# EAGLE design picrocope_hub_v2r2 (EAGLE 9.6.2)
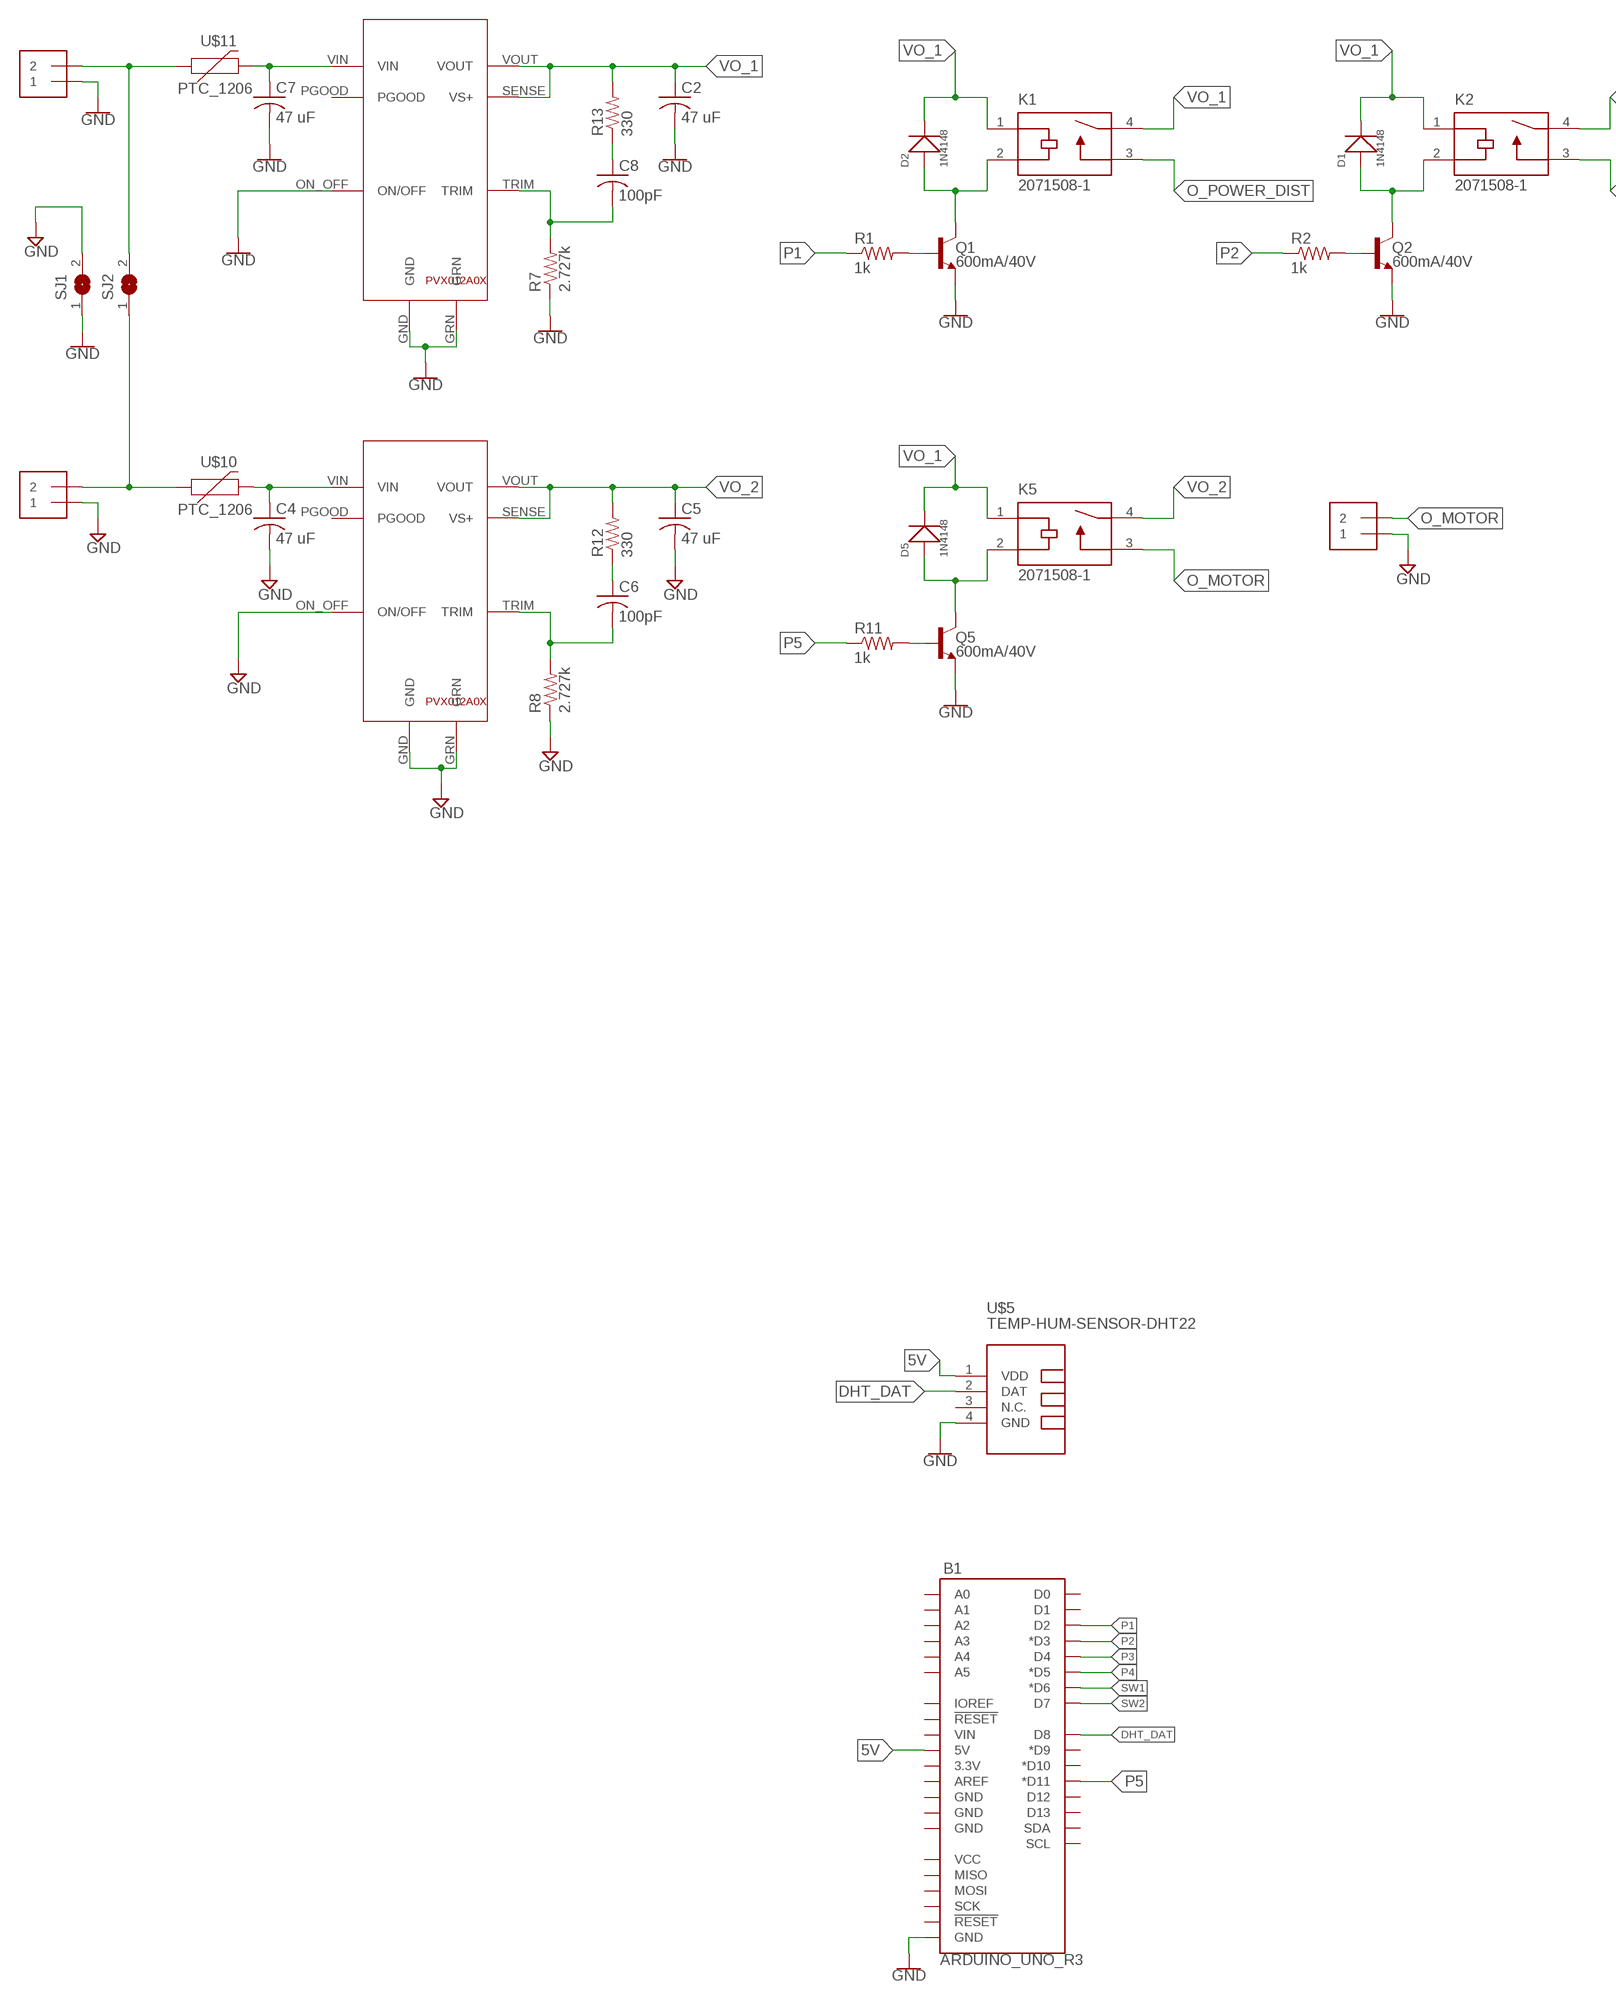
[diagram p0: schematic, sheet 1, part 1 of 2]
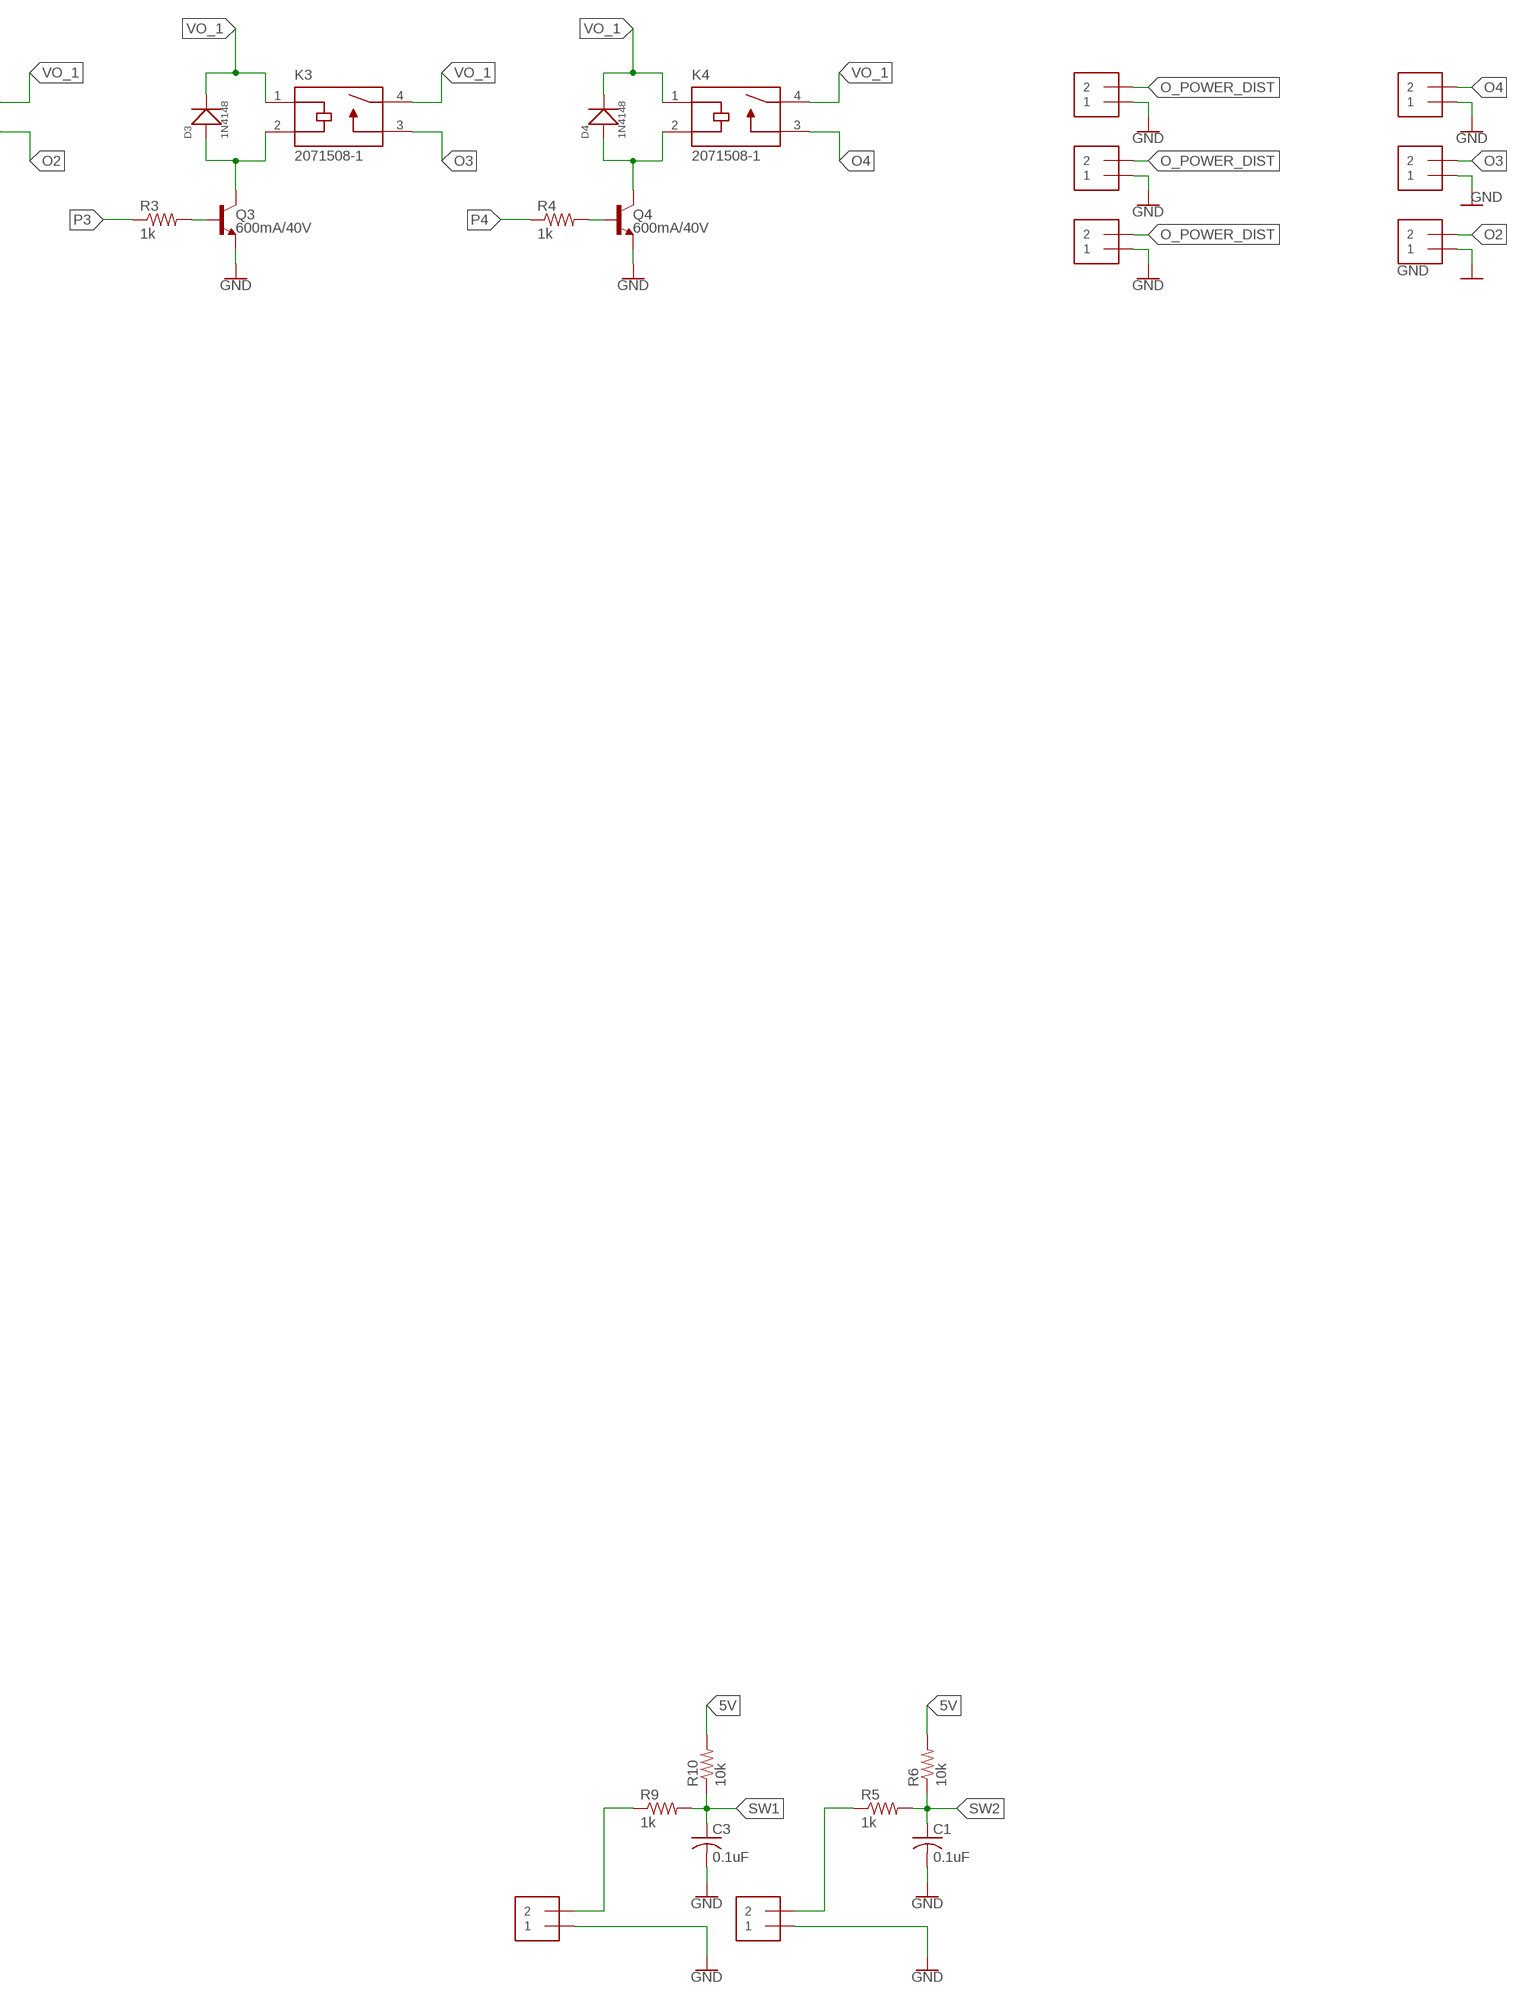
[diagram p1: schematic, sheet 1, part 2 of 2]

## Parts
B1  ARDUINO_UNO_R3  [ARDUINO_R3]
C1  0.1uF  C-USC0603  [C0603]
C2  47 uF  C-USC1210  [C1210]
C3  0.1uF  C-USC0603  [C0603]
C4  47 uF  C-USC1210  [C1210]
C5  47 uF  C-USC1210  [C1210]
C6  100pF  C-USC0603  [C0603]
C7  47 uF  C-USC1210  [C1210]
C8  100pF  C-USC0603  [C0603]
D1  1N4148  SMD-DIODE-SWITCH-1N4148(LL-34)  [LL-34]
D2  1N4148  SMD-DIODE-SWITCH-1N4148(LL-34)  [LL-34]
D3  1N4148  SMD-DIODE-SWITCH-1N4148(LL-34)  [LL-34]
D4  1N4148  SMD-DIODE-SWITCH-1N4148(LL-34)  [LL-34]
D5  1N4148  SMD-DIODE-SWITCH-1N4148(LL-34)  [LL-34]
K1  2071508-1  [RELAY_2071508-1]
K2  2071508-1  [RELAY_2071508-1]
K3  2071508-1  [RELAY_2071508-1]
K4  2071508-1  [RELAY_2071508-1]
K5  2071508-1  [RELAY_2071508-1]
Q1  600mA/40V  TRANS_NPN-MMBT2222AL  [SOT23-3]
Q2  600mA/40V  TRANS_NPN-MMBT2222AL  [SOT23-3]
Q3  600mA/40V  TRANS_NPN-MMBT2222AL  [SOT23-3]
Q4  600mA/40V  TRANS_NPN-MMBT2222AL  [SOT23-3]
Q5  600mA/40V  TRANS_NPN-MMBT2222AL  [SOT23-3]
R1  1k  R-US_R0603  [R0603]
R2  1k  R-US_R0603  [R0603]
R3  1k  R-US_R0603  [R0603]
R4  1k  R-US_R0603  [R0603]
R5  1k  R-US_R0603  [R0603]
R6  10k  R-US_R0603  [R0603]
R7  2.727k  R-US_R0603  [R0603]
R8  2.727k  R-US_R0603  [R0603]
R9  1k  R-US_R0603  [R0603]
R10  10k  R-US_R0603  [R0603]
R11  1k  R-US_R0603  [R0603]
R12  330  R-US_R0603  [R0603]
R13  330  R-US_R0603  [R0603]
SJ1  SJ  [SJ]
SJ2  SJ  [SJ]
U$1  PVX012A0XV1  [PVX012A0X]
U$2  PVX012A0XV1  [PVX012A0X]
U$3  MOLEX_0039301022  [MINI-FIT_JR_CONN]
U$4  MOLEX_0039301022  [MINI-FIT_JR_CONN]
U$5  TEMP-HUM-SENSOR-DHT22  [TEMP-HUM-SENSOR-DHT22]
U$6  MOLEX_0039301022  [MINI-FIT_JR_CONN]
U$7  MOLEX_0039301022  [MINI-FIT_JR_CONN]
U$8  MOLEX_0039301022  [MINI-FIT_JR_CONN]
U$9  MOLEX_0039301022  [MINI-FIT_JR_CONN]
U$10  PTC_1206  [1206]
U$11  PTC_1206  [1206]
U$12  MOLEX_0039301022  [MINI-FIT_JR_CONN]
U$13  MOLEX_0039301022  [MINI-FIT_JR_CONN]
U$14  MOLEX_0039301022  [MINI-FIT_JR_CONN]
U$15  MOLEX_0039296028  [MINI-FIT_JR_VERTICAL_CONN]
U$16  MOLEX_0039296028  [MINI-FIT_JR_VERTICAL_CONN]

## Nets
5V: B1.5V R6.2 R10.2 U$5.1(VDD)
DHT_DAT: B1.D8 U$5.2(DAT)
GND: B1.GND@1(GND) C1.2 C2.2 C3.2 C7.2 Q1.2(E) Q2.2(E) Q3.2(E) Q4.2(E) Q5.2(E) R7.1 SJ1.1 U$1.GND U$1.GRN U$1.ON_OFF(ON/OFF) U$3.P$2 U$5.4(GND) U$6.P$2 U$7.P$2 U$8.P$2 U$9.P$2 U$12.P$2 U$13.P$2 U$15.P$1 U$16.P$1
GND2: C4.2 C5.2 R8.1 SJ1.2 U$2.GND U$2.GRN U$2.ON_OFF(ON/OFF) U$4.P$2 U$14.P$2 ; supply symbol labelled GND
N$1: Q1.1(B) R1.2
N$2: D2.A(+) K1.2(COIL2) Q1.3(C)
N$3: SJ2.1 U$4.P$1 U$10.1
N$4: R5.1 U$16.P$2
N$5: Q2.1(B) R2.2
N$6: D1.A(+) K2.2(COIL2) Q2.3(C)
N$7: Q3.1(B) R3.2
N$8: D3.A(+) K3.2(COIL2) Q3.3(C)
N$9: Q4.1(B) R4.2
N$10: D4.A(+) K4.2(COIL2) Q4.3(C)
N$12: R9.1 U$15.P$2
N$14: Q5.1(B) R11.2
N$15: C6.1 R12.1
N$16: C8.1 R13.1
N$17: D5.A(+) K5.2(COIL2) Q5.3(C)
N$19: C6.2 R8.2 U$2.TRIM
N$20: C8.2 R7.2 U$1.TRIM
N$23: SJ2.2 U$3.P$1 U$11.1
O2: K2.3(NO) U$7.P$1
O3: K3.3(NO) U$8.P$1
O4: K4.3(NO) U$9.P$1
O_MOTOR: K5.3(NO) U$14.P$1
O_POWER_DIST: K1.3(NO) U$6.P$1 U$12.P$1 U$13.P$1
P1: B1.D2 R1.1
P2: B1.D3(*D3) R2.1
P3: B1.D4 R3.1
P4: B1.D5(*D5) R4.1
P5: B1.D11(*D11) R11.1
SW1: B1.D6(*D6) C3.1 R9.2 R10.1
SW2: B1.D7 C1.1 R5.2 R6.1
VIN_1: C7.1 U$1.VIN U$11.2
VIN_2: C4.1 U$2.VIN U$10.2
VO_1: C2.1 D1.C(-) D2.C(-) D3.C(-) D4.C(-) D5.C(-) K1.1(COIL1) K1.4(COM) K2.1(COIL1) K2.4(COM) K3.1(COIL1) K3.4(COM) K4.1(COIL1) K4.4(COM) K5.1(COIL1) R13.2 U$1.SENSE(VS+) U$1.VOUT
VO_2: C5.1 K5.4(COM) R12.2 U$2.SENSE(VS+) U$2.VOUT
Unconnected: B1.3.3V B1.A0 B1.A1 B1.A2 B1.A3 B1.A4 B1.A5 B1.AREF B1.D0 B1.D1 B1.D9(*D9) B1.D10(*D10) B1.D12 B1.D13 B1.GND@2(GND) B1.GND@3(GND) B1.GND@4(GND) B1.IOREF B1.MISO B1.MOSI B1.RESET@1(!RESET!) B1.RESET@2(!RESET!) B1.SCK B1.SCL B1.SDA B1.VCC B1.VIN U$1.PGOOD U$2.PGOOD U$5.3(N.C.)

## Library data of the parts
B1 = SparkFun-Boards:ARDUINO_UNO_R3: Arduino R3 Footprint with SPI header Arduino Uno R3 Compatible Footprint. Matches PCB size of the original board. SparkFun Products: SAMD21 Dev Breakout <https://www.sparkfun.com/products/13672> RedBoard <https://www.sparkfun.com/products/12757> R3 Stackable Headers <https://www.sparkfun.com/products/11417>
C1-C8 = adafruit:C-US: CAPACITOR, American symbol
D1-D5 = Seeed-Diode:SMD-DIODE-SWITCH-1N4148(LL-34): 304040016; MPN: 1N4148
K1-K5 = 2071508-1:2071508-1: Power Relay 5VDC 10A SPST-NO(18.2mm 10.2mm 15.2mm) THT; MANUFACTURER: TE Connectivity; MAXIMUM_PACKAGE_HEIGHT: 15.7mm; PARTREV: 0919; STANDARD: Manufacturer Recommendations
Q1-Q5 = SparkFun-DiscreteSemi:TRANS_NPN: NPN transistor Current controlled devices typically used to amplify current or used as a switch. BC547 - COM-08928 <http://www.sparkfun.com/products/8928> (TO-92 45V 100mA) (1.Collector 2.Base 3.Emitter) 2N3904 - COM-00521 <http://www.sparkfun.com/products/521> (TO-92 40V 200mA) (1.Emitter 2.Base 3.Collector) P2N2222A - COM-12852 <http://www.sparkfun.com/products/12852> (TO-92 40V 600mA) (1.Collector 2.Base 3.Emitter); PROD_ID: TRANS-08049
R1-R6 R9-R11 = resistor:R-US_: RESISTOR, American symbol
R7 R8 R12 R13 = adafruit:R-US_: RESISTOR, American symbol
SJ1 SJ2 = jumper:SJ: SMD solder JUMPER
U$1 U$2 = PVX012A0X:PVX012A0X
U$3 U$4 U$6-U$9 U$12-U$14 = pat:MOLEX_0039301022
U$5 = diy-modules:TEMP-HUM-SENSOR-DHT22: DHT22 - digital humidity & temperature sensor Also known as: AM2302 AM2302 datasheet available here: http://akizukidenshi.com/download/ds/aosong/AM2302.pdf Click here to find device on ebay.com <http://www.ebay.com/sch/dht22+digital+sensor>
U$10 U$11 = pat:PTC_1206
U$15 U$16 = pat:MOLEX_0039296028

## Board
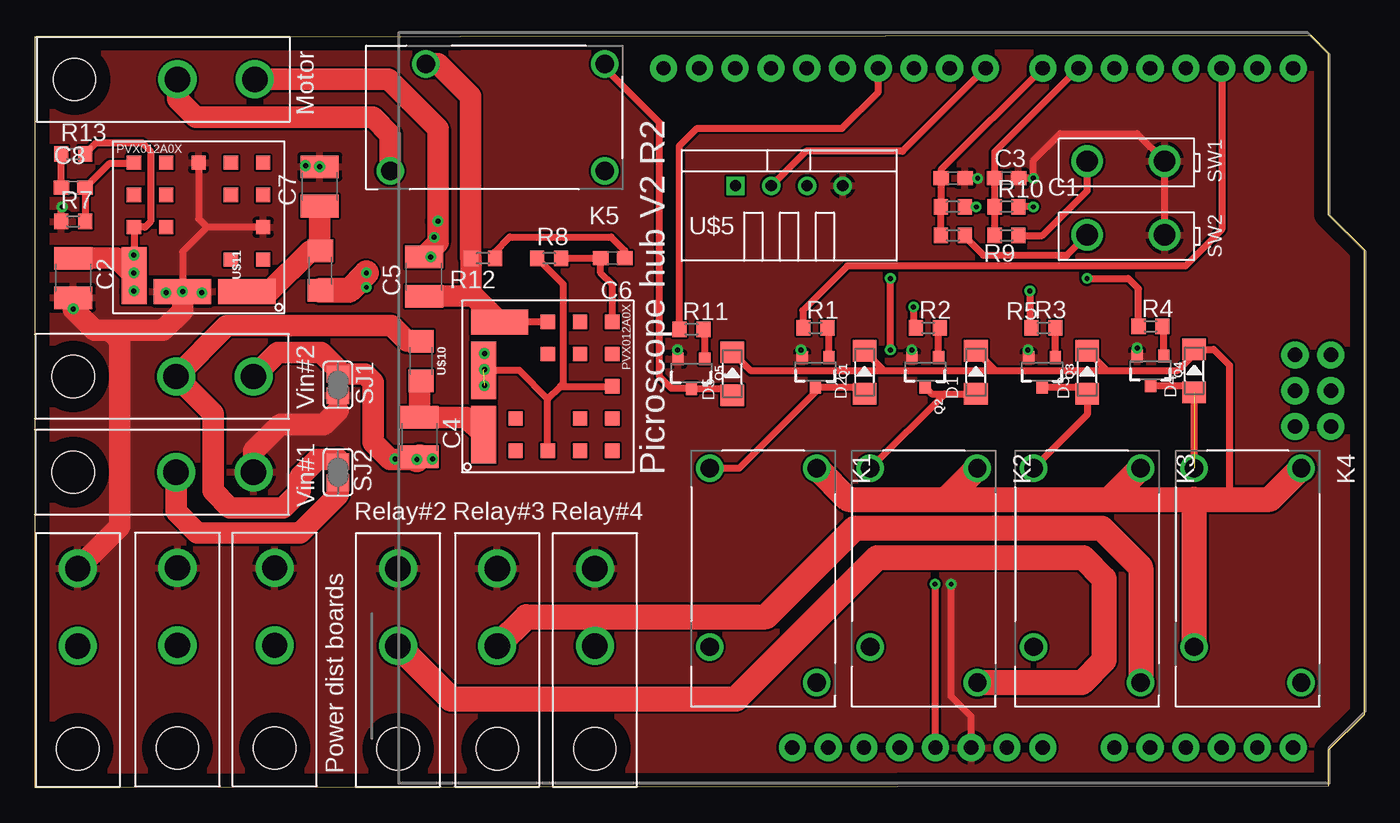
[diagram p2: board, top side]
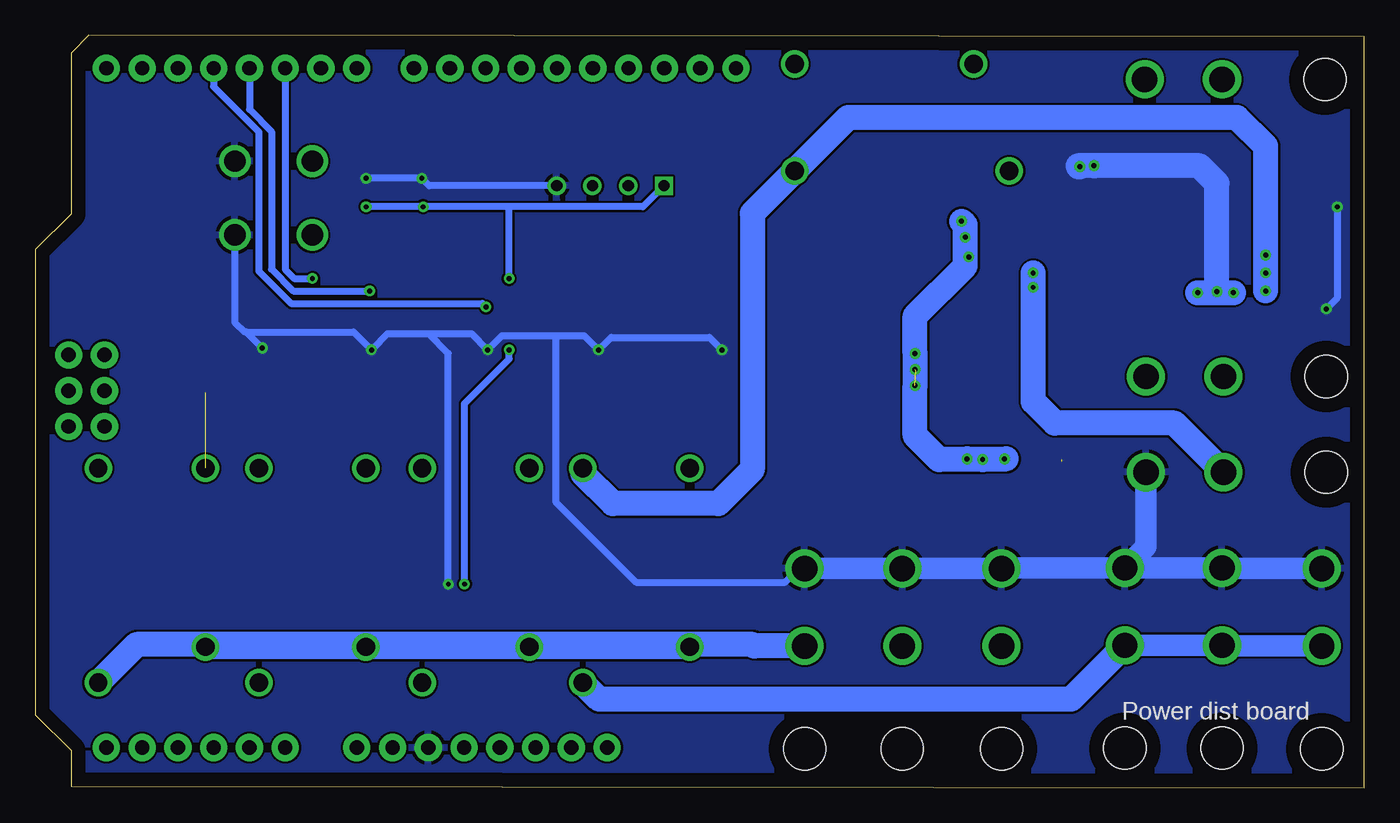
[diagram p3: board, bottom side, seen from below]

Size 94.38 x 53.44 mm. Coordinates in mm from the lower left corner, seen from the top.
Outline: 0,0 0,53.34 90.57,53.44 91.84,52.17 91.84,40.74 94.38,38.2 94.38,5.18 91.84,2.64 91.84,0.1 0,0
Copper layers (1*16): Top 0.035mm / dielectric 1.5mm / Bottom 0.035mm
Design rules "default *": minimum track width 20mil, minimum drill 0.35mm, track to track 6mil, track to pad 6mil, pad to pad 6mil, via to via 6mil, smd to smd 6mil, copper to edge 40mil, drill to drill 6mil, minimum pad ring 10mil, minimum via ring 8mil, stop-mask expansion 4mil, vias tented up to drill 0mil, thermal gap 10mil

### Footprints (pad centres in the part's own frame; a part is rotated, then mirrored left to right if it is on the bottom)
ARDUINO_R3 = drill 1.016 pad 1.93: 3.3V 2.54,-24.13; 5V 5.08,-24.13; A0 17.78,-24.13; A1 20.32,-24.13; A2 22.86,-24.13; A3 25.4,-24.13; A4 27.94,-24.13; A5 30.48,-24.13; AREF -9.144,24.13; D0 30.48,24.13; D1 27.94,24.13; D2 25.4,24.13; D3 22.86,24.13; D4 20.32,24.13; D5 17.78,24.13; D6 15.24,24.13; D7 12.7,24.13; D8 8.636,24.13; D9 6.096,24.13; D10 3.556,24.13; D11 1.016,24.13; D12 -1.524,24.13; D13 -4.064,24.13; GND@1 7.62,-24.13; GND@2 10.16,-24.13; GND@3 -6.604,24.13; GND@4 33.16,-1.32; IOREF -2.54,-24.13; MISO 30.62,3.76; MOSI 33.16,1.22; NC -5.08,-24.13; RESET@1 0,-24.13; RESET@2 30.62,-1.32; SCK 30.62,1.22; SCL -14.224,24.13; SDA -11.684,24.13; VCC 33.16,3.76; VIN 12.7,-24.13
C0603 = smd 1.1 x 1: 1 -0.85,0; 2 0.85,0
C1210 = smd 1.6 x 2.7: 1 -1.4,0; 2 1.4,0
LL-34 = smd 1.524 x 1.676: A -1.524,0; C 1.524,0
RELAY_2071508-1 = drill 1.3: 1 -7.85,3.8; 2 -7.85,-3.8; 3 7.39,3.8; 4 4.85,-3.8
SOT23-3 = smd 0.8 x 0.9: 1 -0.95,-1; 2 0.95,-1; 3 0,1.1
R0603 = smd 1 x 1.1: 1 -0.85,0; 2 0.85,0
SJ = smd 1.168 x 1.6: 1 -0.762,0; 2 0.762,0
PVX012A0X = smd 1.01 x 1.01: 8 3.81,1.52; 9 1.52,1.52; 11 3.81,3.81; 12 8.39,3.81; 13 8.39,6.1; 14 10.68,3.81; 15 8.39,1.52; 16 1.52,8.39; 17 3.81,8.39; GND 6.1,1.52; ON_OFF 1.52,6.1; PGOOD 1.52,3.81; SENSE 10.68,6.1; TRIM 10.68,1.52 | smd 4.07 x 1.77: GRN 7.24,10.67; VIN 2.67,10.67 | smd 1.77 x 4.07: VOUT 10.67,9.53
MINI-FIT_JR_CONN = drill 1.8: P$1 0,0; P$2 0,5.5 | hole 3: 0,-7.3
TEMP-HUM-SENSOR-DHT22 = drill 0.8 square: 1 -3.81,0 | drill 0.8: 2 -1.27,0; 3 1.27,0; 4 3.81,0
1206 = smd 1.6 x 1.8: 1 -1.4,0; 2 1.4,0
MINI-FIT_JR_VERTICAL_CONN = drill 1.5: P$1 0,0.1; P$2 0,5.6

### Placement (x,y rotation side)
B1  58.85,26.97 0 top
C1  65.17,43.28 0 top
C2  2.7,36.2 270 top
C3  68.98,43.28 0 top
C4  27.3,24.9 270 top
C5  27.6,36.3 90 top
C6  41,37.6 180 top
C7  20.2,42.7 90 top
C8  2.7,42.6 0 top
D1  66.8,29.5 90 top
D2  58.89,29.5 90 top
D3  74.7,29.5 90 top
D4  82.3,29.6 90 top
D5  49.5,29.4 90 top
K1  51.7,14.84 270 top
K2  63.1,14.84 270 top
K3  74.7,14.84 270 top
K4  86.1,14.84 270 top
K5  32.6,47.6 180 top
Q1  55.41,29.55 180 top
Q2  63.2,29.55 180 top
Q3  71.5,29.55 180 top
Q4  79.2,29.65 180 top
Q5  46.6,29.45 180 top
R1  55.41,32.65 0 top
R2  63.4,32.65 0 top
R3  71.6,32.65 0 top
R4  79.2,32.75 0 top
R5  65.17,39.22 180 top
R6  65.17,41.25 0 top
R7  2.7,40.2 0 top
R8  36.5,37.6 0 top
R9  68.98,39.22 180 top
R10  68.98,41.25 0 top
R11  46.6,32.55 0 top
R12  31.8,37.6 180 top
R13  2.7,45 0 top
SJ1  21.5,28.6 90 top
SJ2  21.5,22.4 270 top
U$1  17.7,45.9 180 top
U$2  42.5,22.4 90 top
U$3  10,22.4 270 top
U$4  10,29.2 270 top
U$5  53.54,42.75 0 top
U$6  3.02,10.06 0 top
U$7  25.76,10.06 0 top
U$8  32.81,10.06 0 top
U$9  39.75,10.06 0 top
U$10  27.4,30.3 270 top
U$11  20.25,36.72 90 top
U$12  17,10.1 0 top
U$13  10.1,10.1 0 top
U$14  10.1,50.3 270 top
U$15  80.3,44.49 90 top
U$16  80.3,39.26 90 top

### Tracks (layer width: path | path; a pad name or v marks a point on that pad's centre or on a via)
5V  (via drill 0.35)
  Top 0.508: R6.2 v66.82,41.25 | v70.89,41.25 R10.2 | B1.5V 63.93,14.42 v63.9,14.45 | v60.72,31.09 v60.72,36.17
  Bottom 0.508: v70.89,41.25 v66.82,41.25 60.85,41.25 | U$5.1 51.23,41.25 60.85,41.25 | v63.9,14.45 63.9,27.28 60.72,30.45 v60.72,31.09 | v60.72,36.17 60.72,41.12 60.85,41.25
DHT_DAT
  Top 0.508: B1.D8 61.58,45.2 54.72,45.2 U$5.2
GND  (via drill 0.35)
  Top 0.508: U$1.ON_OFF 12.2,39.8 | 12.2,39.8 10.46,38.06 U$1.GRN | U$1.GND 11.6,40.4 12.2,39.8 | U$16.P$1 U$15.P$1 78.23,46.45 72.79,46.45 70.89,44.55 v70.89,43.28 C3.2 | Q5.2 45.65,31.05 v45.61,31.09 | v78.25,31.21 Q4.2 | v70.5,31.09 70.55,31.04 Q3.2 | v62.25,31.09 Q2.2 | v54.38,31.09 54.46,31.01 Q1.2 | R7.1 1.85,41.17 v1.92,41.25 | C1.2 v66.92,43.28 | B1.GND@1 66.47,5.03 65.04,6.45 v65.04,14.45
  Top 1.27: 21.5,26.8 SJ1.1
  Top 1.524: U$3.P$2 15.5,23.9 17.4,25.8 20.5,25.8 21.5,26.8 | U$1.GRN 10.46,33.86 9.1,32.5 5.3,32.5 | 5.3,32.5 4.2,32.5 v2.7,34 C2.2 | 5.3,32.5 6,31.8 6,18.54 U$6.P$2
  Bottom 0.508: v45.61,31.09 46.5,31.98 53.49,31.98 v54.38,31.09 55.39,32.1 57.17,32.1 | 57.17,32.1 61.23,32.1 v62.25,31.09 63.39,32.23 66.44,32.23 | 66.44,32.23 69.36,32.23 v70.5,31.09 71.77,32.36 79.39,32.36 | 78.25,31.09 v78.25,31.21 79.39,32.36 | v1.92,41.25 1.92,34.78 v2.7,34 | U$9.P$2 40.14,15.56 41.12,14.58 51.71,14.58 57.42,20.29 57.42,31.85 57.17,32.1 | v70.89,43.28 v66.92,43.28 66.39,42.75 U$5.4 | U$16.P$1 80.2,33.04 79.52,32.36 79.39,32.36 | v65.04,14.45 65.04,30.83 66.44,32.23
  Bottom 1.524: U$6.P$2 10.06,15.56 U$13.P$2 U$12.P$2 | U$12.P$2 25.72,15.6 U$7.P$2 U$8.P$2 40.14,15.56 40.3,15.4 | U$3.P$2 15.5,17.1 U$12.P$2
  Bottom 1.778: U$1.GRN 10.46,42.93 11.7,44.17 v19.2,44.17 20.34,44.17 20.27,44.1 C7.2
  other vias: 10.46,35.23 20.2,44.1
  pour Top: -2.18,55.98 -2.18,-4.98 96.92,-4.98 96.92,55.98
  pour Bottom: -2.18,55.98 -2.18,-4.98 96.92,-4.98 96.92,55.98
GND2  (via drill 0.35)  (2 unrouted)
  Top 0.508: U$2.ON_OFF 36.4,27.6 | 37.3,28.5 U$2.GND | 36.4,27.6 37.3,28.5 | U$2.GRN 34.36,29.64 36.4,27.6 | R8.1 37.5,35.75 37.5,28.7 37.3,28.5
  Top 1.524: U$4.P$2 17.2,30.9 20.3,30.9 21.5,29.7 SJ1.2 23.44,29.36 24,28.8 24,24.5 25.2,23.3 v27.1,23.3 | U$14.P$2 25.1,50.3 28.6,46.8 v28.6,40.23 28.6,38.7 C5.2
  Top 1.778: C4.2 v27.1,23.3
  Bottom 1.778: v27.1,23.3 30.2,23.3 31.9,24.99 v31.9,28.55 v31.9,30.83 31.9,33.5 28.34,37.06 v28.34,39.09 28.34,39.97 v28.6,40.23
  other vias: 31.9,29.69
N$1
  Top 0.508: Q1.1 56.36,32.55 R1.2
N$2
  Top 0.508: K1.2 50,22.69 55.41,28.1 Q1.3 58.42,28.45 D2.A
N$3  (1 unrouted)
  Top 1.524: 21.5,23.31 20.01,23.31 18.8,22.1 18.8,21.08 17.6,19.88 13.82,19.88 12.64,21.06 12.64,26.56 U$4.P$1 13.6,32.8 25.3,32.8 26.4,31.7 U$10.1
N$4
  Top 0.508: R5.1 66.02,39.13 67.33,37.82 73.26,37.82 U$16.P$2
N$5
  Top 0.508: Q2.1 64.15,32.55 R2.2
N$6
  Top 0.508: Q2.3 63.67,27.97 D1.A 64.58,27.97 K2.2
N$7
  Top 0.508: Q3.1 R3.2
N$8
  Top 0.508: Q3.3 74.23,28.45 D3.A 74.7,26.49 K3.2
N$9
  Top 0.508: Q4.1 80.15,32.65 R4.2
N$10  (1 unrouted)
  Top 0.508: K4.2 D4.A 81.83,28.55 Q4.3
N$11  (via drill 0.35)
  other vias: 9.29,35.15
N$12
  Top 0.508: R9.1 71.52,39.22 74.7,42.4 U$15.P$2
N$13  (via drill 0.35)
  Bottom 1.778: v11.83,35.15 9.29,35.15
N$14
  Top 0.508: Q5.1 47.55,32.45 R11.2
N$15
  Top 0.508: R12.1 32.65,38.05 33.7,39.1 40.9,39.1 41.85,38.15 C6.1
N$16
  Top 0.508: C8.1 R13.1
N$17
  Top 0.508: D5.A 49.03,28.35 Q5.3 45.18,28.35 44.34,29.18 44.34,47.22 40.45,51.11 K5.2
N$18  (via drill 0.35)
  Bottom 1.778: v28.21,23.34 25.42,23.34
N$19
  Top 0.508: U$2.TRIM 40.98,35.72 40.15,36.55 C6.2 R8.2
N$20
  Top 0.508: U$1.TRIM 6.94,44.3 5.25,44.3 C8.2 R7.2
N$21  (via drill 0.35)
  other vias: 25.55,23.34
N$22  (via drill 0.35)
  other vias: 28.09,37.69
N$23  (via drill 0.35)
  Top 1.524: U$3.P$1 10,19.6 11.5,18.1 18.8,18.1 21.5,20.8 SJ2.2
  Top 1.778: v23.51,36.55 22.28,35.32 U$11.1
  Bottom 1.778: v23.51,36.55 v23.51,35.53 23.51,27.41 21.99,25.88 13.48,25.88 U$3.P$1
O2
  Top 1.778: U$7.P$1 29.52,6.3 49.77,6.3 59.8,16.34 74.4,16.34 75.9,14.84 75.9,9.04 74.31,7.45 K2.3
O3
  Top 1.778: U$8.P$1 34.88,12.14 51.9,12.14 58.2,18.44 75.71,18.44 78.5,15.65 K3.3
O4
  Bottom 1.778: U$9.P$1 43.31,10.06 43.42,10.17 87.18,10.17 K4.3
O_MOTOR
  Top 1.524: U$14.P$1 10.1,48.9 11.4,47.6 24,47.6 25.21,46.39 K5.3
O_POWER_DIST
  Bottom 1.524: U$6.P$1 10.06,10.06 U$13.P$1 U$12.P$1
  Bottom 1.778: U$12.P$1 20.83,6.27 54.33,6.27 K1.3
P1
  Top 0.508: B1.D2 84.25,39.62 81.68,37.06 57.68,37.06 54.5,33.88 54.5,32.71 R1.1
P2  (via drill 0.35)
  Top 0.508: v62.38,34.14 62.38,32.82 R2.1
  Bottom 0.508: B1.D3 81.71,49.78 78.5,46.58 78.5,36.68 76.22,34.39 62.63,34.39 v62.38,34.14
P3  (via drill 0.35)
  Top 0.508: v70.63,35.28 70.63,32.77 R3.1
  Bottom 0.508: B1.D4 79.17,48.18 77.59,46.6 77.59,36.82 76.05,35.28 v70.63,35.28
P4  (via drill 0.35)
  Top 0.508: R4.1 78.35,35.43 77.62,36.17 v74.7,36.17
  Bottom 0.508: B1.D5 76.63,36.79 76,36.17 v74.7,36.17
P5
  Top 0.508: R11.1 45.75,45.58 47.01,46.84 57.3,46.84 59.86,49.4 B1.D11
SW1
  Top 0.508: B1.D6 68.13,45.14 C3.1 R10.1 R9.2
SW2
  Top 0.508: B1.D7 64.32,43.87 C1.1 R6.1 R5.2
VIN_1
  Top 1.524: U$1.VIN 16.63,35.23 19.52,38.12 U$11.2 20.2,38.17 C7.1
VIN_2
  Top 1.524: U$10.2 27.3,28.8 C4.1 30.6,26.3 U$2.VIN
VO_1  (via drill 0.35)
  Top 0.508: U$1.VOUT U$1.SENSE 7.8,39.8 8.2,40.2 8.2,45.2 7.6,45.8 4.35,45.8 R13.2 | 76.13,29.59 81.09,29.59 82.3,30.8 D4.C 83.68,31.12 84.8,30 84.8,20.47 | 76.13,29.59 68.23,29.59 | 68.23,29.59 60.32,29.59 | 60.32,29.59 50.83,29.59 D5.C | D2.C 60.32,29.59 | D1.C 68.23,29.59 | D3.C 76.13,29.59
  Top 1.524: C2.1 5.8,37.6 U$1.VOUT
  Top 1.778: K1.1 57.72,20.47 64.68,20.47 | 64.68,20.47 K2.1 | 64.68,20.47 76.28,20.47 | 76.28,20.47 K3.1 | 76.28,20.47 82.3,20.47 | 82.3,20.47 84.8,20.47 87.68,20.47 K4.1 | K4.4 82.3,20.47 | U$1.VOUT 7.03,35.3 v7,35.28
  Bottom 1.778: K1.4 K2.4 K3.4 K4.4 | v7,35.28 v7,36.55 v7,37.82 7,45.57 9.04,47.6 36.65,47.6 K5.1 43.45,40.8 43.45,22.58 45.87,20.17 53.36,20.17 55.5,22.31 K1.1
VO_2
  Top 0.508: U$2.SENSE U$2.VOUT
  Top 1.524: C5.1 31.14,34.9 | 31.14,34.9 U$2.VOUT | 31.14,34.9 30.95,35.09 R12.2 30.9,37.65 30.9,49.1 28.6,51.4 K5.4

### Text on the board
tPlace: Motor | SW1 | SW2 | Vin#2 | Picroscope hub V2 R2 | Vin#1 | Relay#2 | Relay#3 | Relay#4 | Power dist boards
bPlace: - + | - + | Power dist board